# Altium schematic sheet Current Sensors.SchDoc
size A4
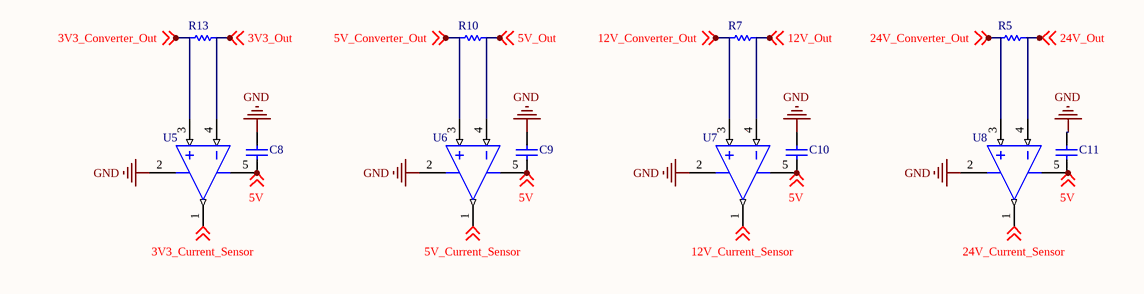
[diagram p0: Current Sensors.SchDoc]

## Parts
C8  0.1μF  [Cap 0805]  (value not drawn)
C9  0.1μF  [Cap 0805]  (value not drawn)
C10  0.1μF  [Cap 0805]  (value not drawn)
C11  0.1μF  [Cap 0805]  (value not drawn)
R5  10 mOhms  [RESC0805(2012)_N]  (value not drawn)
R7  15 mOhms  [RESC0805(2012)_N]  (value not drawn)
R10  20 mOhms  [RESC0805(2012)_N]  (value not drawn)
R13  25 mOhms  [RESC0805(2012)_N]  (value not drawn)
U5  INA194AIDBVR  [DBV0005A_L]  (value not drawn)
U6  INA194AIDBVR  [DBV0005A_L]  (value not drawn)
U7  INA194AIDBVR  [DBV0005A_L]  (value not drawn)
U8  INA194AIDBVR  [DBV0005A_L]  (value not drawn)

## Nets
GND: C8.2 C9.2 C10.2 C11.2 U5.2(GND) U6.2(GND) U7.2(GND) U8.2(GND)
3V3_Converter_Out: R13.1 U5.3(VIN+) ; off-sheet 3V3_Converter_Out
3V3_Current_Sensor: U5.1(OUT) ; off-sheet 3V3_Current_Sensor
3V3_Out: R13.2 U5.4(VIN-) ; off-sheet 3V3_Out
5V: C8.1 C9.1 C10.1 C11.1 U5.5(V+) U6.5(V+) U7.5(V+) U8.5(V+) ; off-sheet 5V
5V_Converter_Out: R10.1 U6.3(VIN+) ; off-sheet 5V_Converter_Out
5V_Current_Sensor: U6.1(OUT) ; off-sheet 5V_Current_Sensor
5V_Out: R10.2 U6.4(VIN-) ; off-sheet 5V_Out
12V_Converter_Out: R7.1 U7.3(VIN+) ; off-sheet 12V_Converter_Out
12V_Current_Sensor: U7.1(OUT) ; off-sheet 12V_Current_Sensor
12V_Out: R7.2 U7.4(VIN-) ; off-sheet 12V_Out
24V_Converter_Out: R5.1 U8.3(VIN+) ; off-sheet 24V_Converter_Out
24V_Current_Sensor: U8.1(OUT) ; off-sheet 24V_Current_Sensor
24V_Out: R5.2 U8.4(VIN-) ; off-sheet 24V_Out

## Notes on the sheet
- Title
- Size:
- Date:
- A4
- Number:
- Time:
- Revision:
- Sheet
- of
- File:

## Library data of the parts
C8-C11 = Capacitor 0805: Standard Capacitor; Mounting Technology: SurfaceMount; Case Size/Dimension: 0805; Package Reference: 0805; Capacitance: 0.1μF
R5 R7 R10 R13 = Resistor 0805: Generic 0805 Resistor; Case-EIA: 0805; Technology: SMT
  R5: Value: 10 mOhms
  R7: Value: 15 mOhms
  R10: Value: 20 mOhms
  R13: Value: 25 mOhms
U5-U8 = TI-INA1XXDBV5: Voltage Output High-Side Measurement Current Shunt Monitor, 2.7 to 18 V, -40 to 125 degC, 5-pin SOT23 (DBV5), Green (RoHS & no Sb/Br); Manufacturer: Texas Instruments; Quiescent Current (+/-)(Typ)(mA): 0.7; Input Offset (+/-)(Max)(uV): 2000; Gain(V/V): 50; Vs(Min)(V): 2.7; Rating: Catalog; Small-Signal Bandwidth(Typ)(MHz): 0.3; CMRR(Min)(dB): 80; Common Mode Range(Min)(V): -16; Vs(Max)(V): 18; ComponentLink2Description: Datasheet; Eco-Plan: Green (RoHS & no Sb/Br); ComponentLink1URL: http://www.ti.com/; Code_JEDEC: MO-178; SubFamily: Current Shunt Monitor; ComponentLink3URL: http://www.ti.com/lit/ml/mpds018j/mpds018j.pdf; PackageVersion: 4073253-4/K, 03/2006; PartNumber: INA194AIDBVR; DatasheetVersion: SBOS307F; ComponentLink1Description: Manufacturer URL; ComponentLink3Description: Package Specification; Output Type: Voltage; Mounting Technology: Surface Mount; ComponentLink2URL: http://www.ti.com/general/docs/lit/getliterature.tsp?genericPartNumber=INA194&fileType=pdf; Common Mode Range(Max)(V): 80; PackageDescription: 5-Pin Plastic Small Outline, Body 1.6 x 2.9 mm, Pitch 0.95 mm; PackageReference: DBV0005A